# Altium schematic sheet [10] - CPU - GPIO, PWM, LEDS, BUTTONS.SchDoc
size A2; DocumentNumber: 10; SheetNumber: 10; SheetTotal: 31
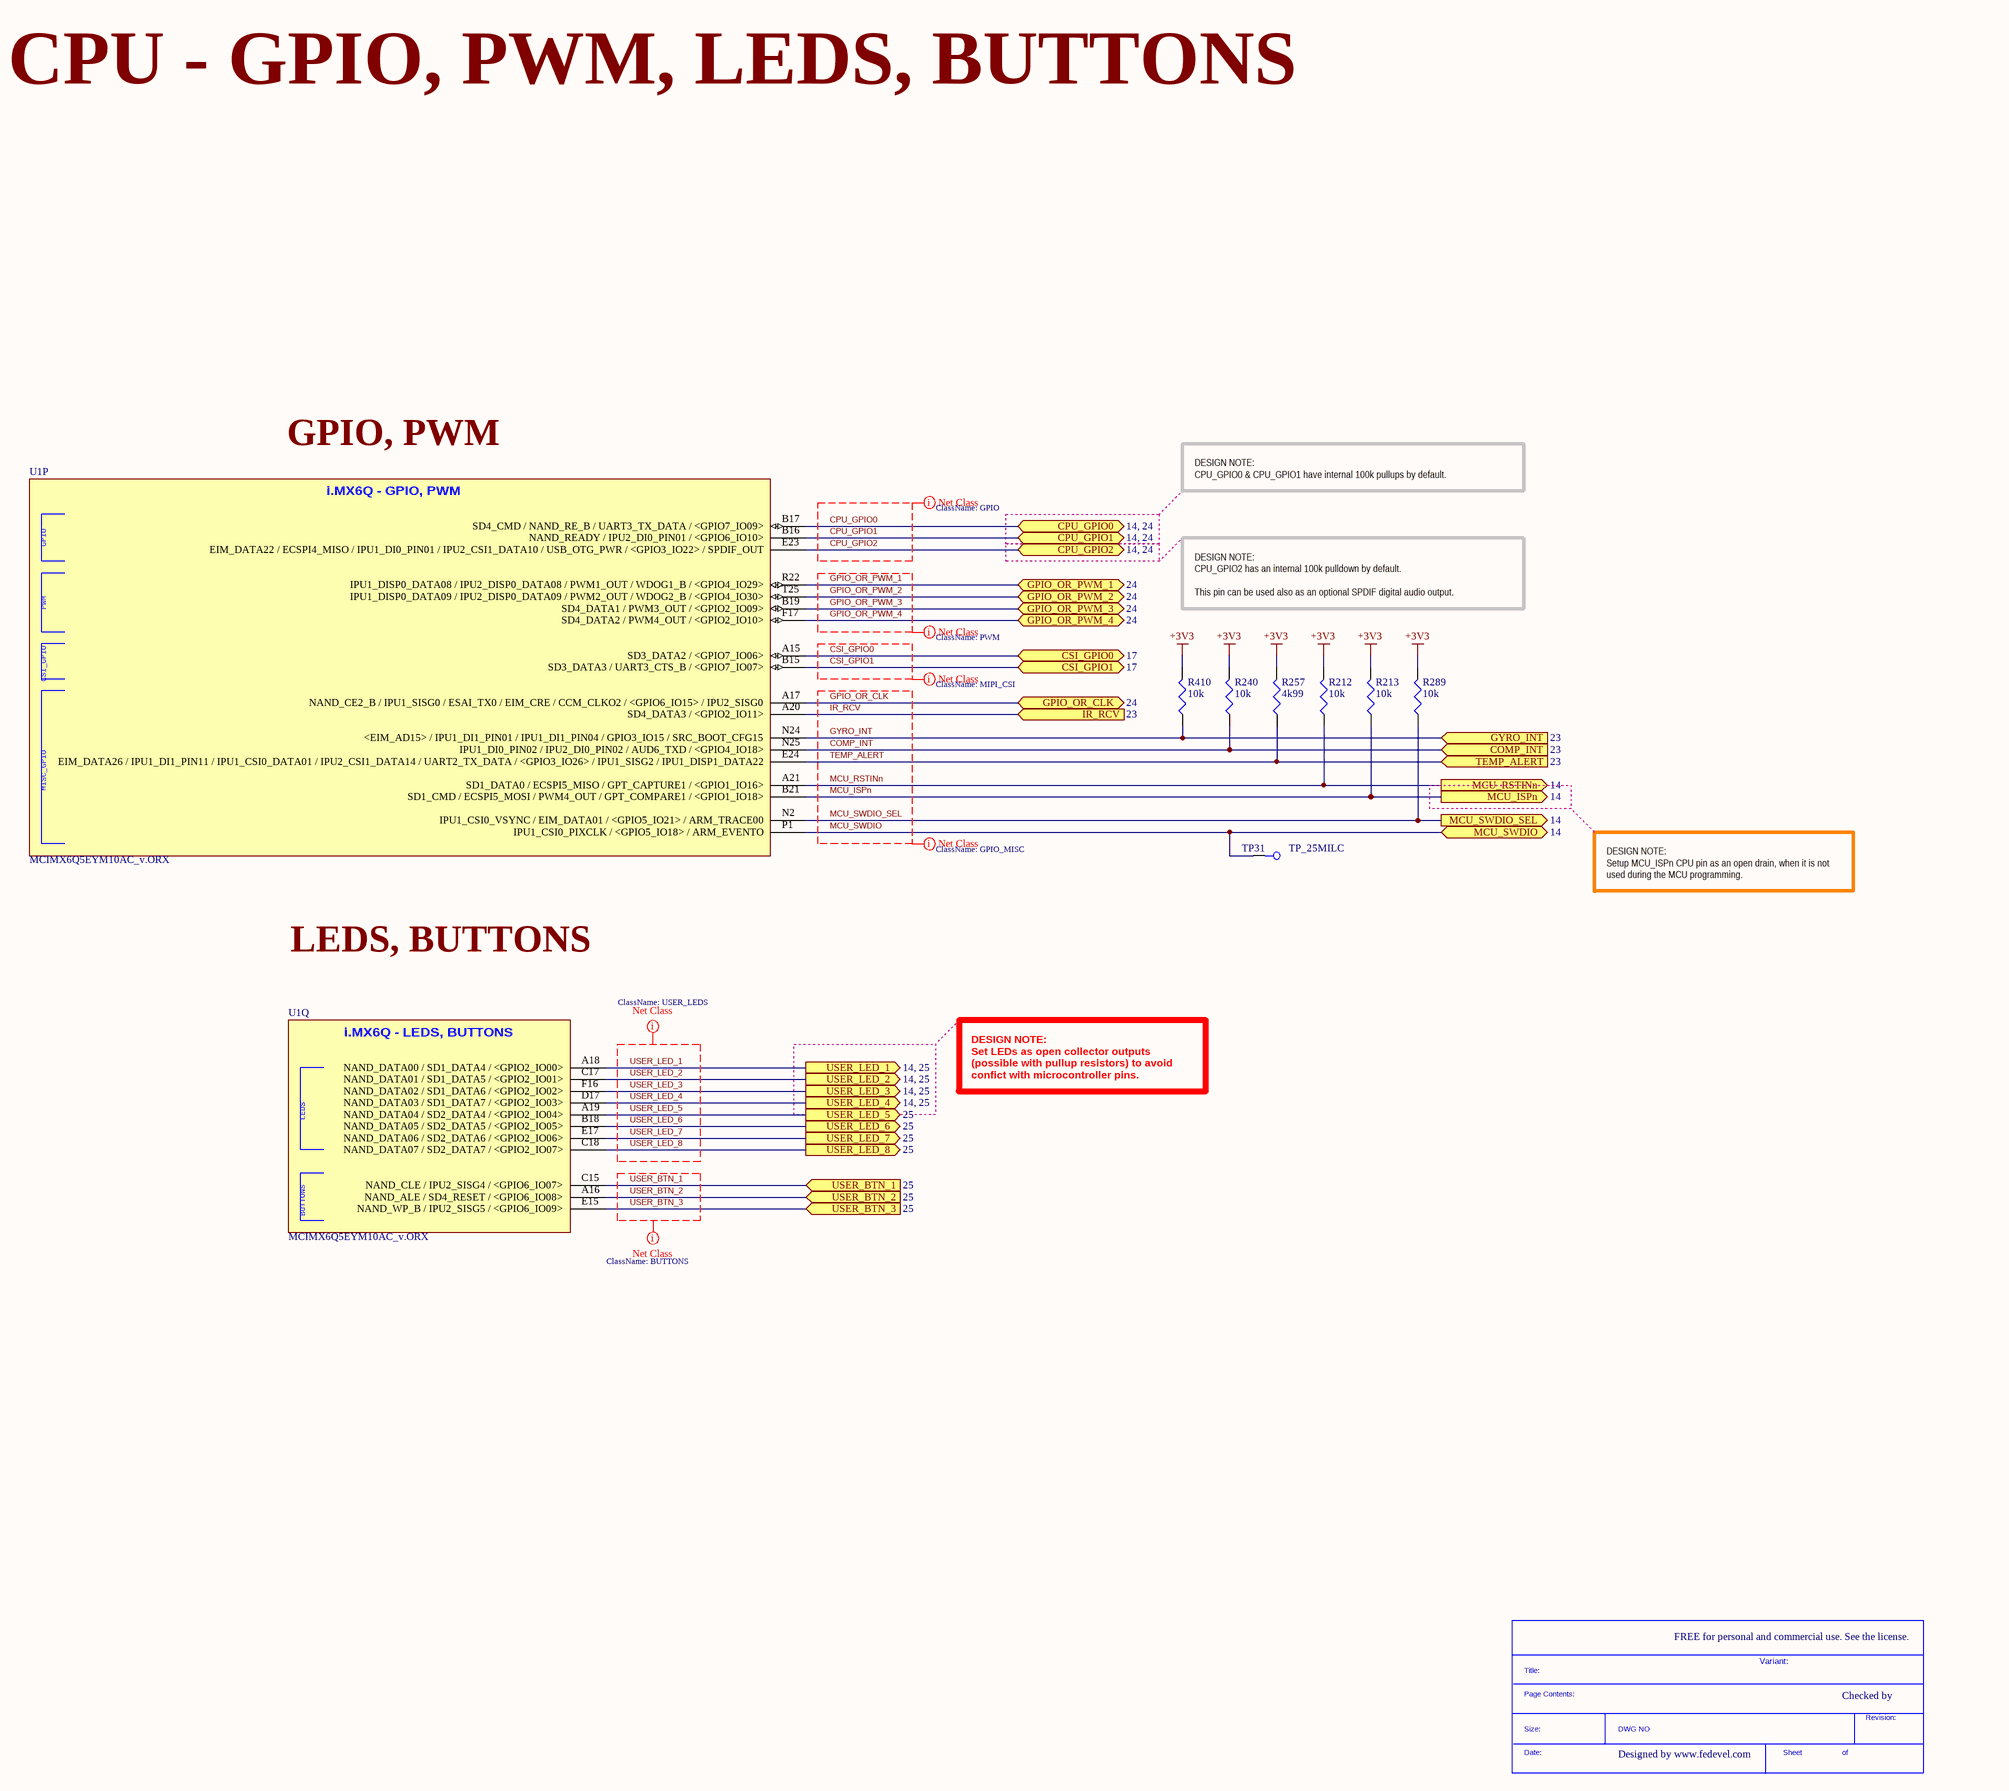
[diagram p0: [10] - CPU - GPIO, PWM, LEDS, BUTTONS.SchDoc]

## Parts
*  SDTitleBlock  (value not drawn)  (graphical)
R212  10k  [R0402]
R213  10k  [R0402]
R240  10k  [R0402]
R257  4k99  [R0402]
R289  10k  [R0402]
R410  10k  [R0402]
TP31  TP_25MILC  [TP_25C]  (no BOM)
U1  MCIMX6Q5EYM10AC_v.ORX  [PBGA624]  (parts P,Q of 21)

## Ports
COMP_INT (in, see 23), CPU_GPIO0 (bidir, see 14, 24), CPU_GPIO1 (bidir, see 14, 24), CPU_GPIO2 (bidir, see 14, 24), CSI_GPIO0 (bidir, see 17), CSI_GPIO1 (bidir, see 17), GPIO_OR_CLK (bidir, see 24), GPIO_OR_PWM_1 (bidir, see 24), GPIO_OR_PWM_2 (bidir, see 24), GPIO_OR_PWM_3 (bidir, see 24), GPIO_OR_PWM_4 (bidir, see 24), GYRO_INT (in, see 23), IR_RCV (in, see 23), MCU_ISPn (out, see 14), MCU_RSTINn (out, see 14), MCU_SWDIO (bidir, see 14), MCU_SWDIO_SEL (out, see 14), TEMP_ALERT (in, see 23), USER_BTN_1 (in, see 25), USER_BTN_2 (in, see 25), USER_BTN_3 (in, see 25), USER_LED_1 (out, see 14, 25), USER_LED_2 (out, see 14, 25), USER_LED_3 (out, see 14, 25), USER_LED_4 (out, see 14, 25), USER_LED_5 (out, see 25), USER_LED_6 (out, see 25), USER_LED_7 (out, see 25), USER_LED_8 (out, see 25)

## Nets
+3V3: R212.2 R213.2 R240.2 R257.2 R289.2 R410.2
COMP_INT: R240.1 U1.N25(IPU1_DI0_PIN02_/_IPU2_DI0_PIN02_/_AUD6_TXD_/_<GPIO4_IO18>) ; port COMP_INT
CPU_GPIO0: U1.B17(SD4_CMD_/_NAND_RE_B_/_UART3_TX_DATA_/_<GPIO7_IO09>) ; port CPU_GPIO0
CPU_GPIO1: U1.B16(NAND_READY_/_IPU2_DI0_PIN01_/_<GPIO6_IO10>) ; port CPU_GPIO1
CPU_GPIO2: U1.E23(EIM_DATA22_/_ECSPI4_MISO_/_IPU1_DI0_PIN01_/_IPU2_CSI1_DATA10_/_USB_OTG_PWR_/_<GPIO3_IO22>_/_SPDIF_OUT) ; port CPU_GPIO2
CSI_GPIO0: U1.A15(SD3_DATA2_/_<GPIO7_IO06>) ; port CSI_GPIO0
CSI_GPIO1: U1.B15(SD3_DATA3_/_UART3_CTS_B_/_<GPIO7_IO07>) ; port CSI_GPIO1
GPIO_OR_CLK: U1.A17(NAND_CE2_B_/_IPU1_SISG0_/_ESAI_TX0_/_EIM_CRE_/_CCM_CLKO2_/_<GPIO6_IO15>_/_IPU2_SISG0) ; port GPIO_OR_CLK
GPIO_OR_PWM_1: U1.R22(IPU1_DISP0_DATA08_/_IPU2_DISP0_DATA08_/_PWM1_OUT_/_WDOG1_B_/_<GPIO4_IO29>) ; port GPIO_OR_PWM_1
GPIO_OR_PWM_2: U1.T25(IPU1_DISP0_DATA09_/_IPU2_DISP0_DATA09_/_PWM2_OUT_/_WDOG2_B_/_<GPIO4_IO30>) ; port GPIO_OR_PWM_2
GPIO_OR_PWM_3: U1.B19(SD4_DATA1_/_PWM3_OUT_/_<GPIO2_IO09>) ; port GPIO_OR_PWM_3
GPIO_OR_PWM_4: U1.F17(SD4_DATA2_/_PWM4_OUT_/_<GPIO2_IO10>) ; port GPIO_OR_PWM_4
GYRO_INT: R410.1 U1.N24(<EIM_AD15>_/_IPU1_DI1_PIN01_/_IPU1_DI1_PIN04_/_GPIO3_IO15_/_SRC_BOOT_CFG15) ; port GYRO_INT
IR_RCV: U1.A20(SD4_DATA3_/_<GPIO2_IO11>) ; port IR_RCV
MCU_ISPn: R213.1 U1.B21(SD1_CMD_/_ECSPI5_MOSI_/_PWM4_OUT_/_GPT_COMPARE1_/_<GPIO1_IO18>) ; port MCU_ISPn
MCU_RSTINn: R212.1 U1.A21(SD1_DATA0_/_ECSPI5_MISO_/_GPT_CAPTURE1_/_<GPIO1_IO16>) ; port MCU_RSTINn
MCU_SWDIO: TP31.1 U1.P1(IPU1_CSI0_PIXCLK_/_<GPIO5_IO18>_/_ARM_EVENTO) ; port MCU_SWDIO
MCU_SWDIO_SEL: R289.1 U1.N2(IPU1_CSI0_VSYNC_/_EIM_DATA01_/_<GPIO5_IO21>_/_ARM_TRACE00) ; port MCU_SWDIO_SEL
TEMP_ALERT: R257.1 U1.E24(EIM_DATA26_/_IPU1_DI1_PIN11_/_IPU1_CSI0_DATA01_/_IPU2_CSI1_DATA14_/_UART2_TX_DATA_/_<GPIO3_IO26>_/_IPU1_SISG2_/_IPU1_DISP1_DATA22) ; port TEMP_ALERT
USER_BTN_1: U1.C15(NAND_CLE_/_IPU2_SISG4_/_<GPIO6_IO07>) ; port USER_BTN_1
USER_BTN_2: U1.A16(NAND_ALE_/_SD4_RESET_/_<GPIO6_IO08>) ; port USER_BTN_2
USER_BTN_3: U1.E15(NAND_WP_B_/_IPU2_SISG5_/_<GPIO6_IO09>) ; port USER_BTN_3
USER_LED_1: U1.A18(NAND_DATA00_/_SD1_DATA4_/_<GPIO2_IO00>) ; port USER_LED_1
USER_LED_2: U1.C17(NAND_DATA01_/_SD1_DATA5_/_<GPIO2_IO01>) ; port USER_LED_2
USER_LED_3: U1.F16(NAND_DATA02_/_SD1_DATA6_/_<GPIO2_IO02>) ; port USER_LED_3
USER_LED_4: U1.D17(NAND_DATA03_/_SD1_DATA7_/_<GPIO2_IO03>) ; port USER_LED_4
USER_LED_5: U1.A19(NAND_DATA04_/_SD2_DATA4_/_<GPIO2_IO04>) ; port USER_LED_5
USER_LED_6: U1.B18(NAND_DATA05_/_SD2_DATA5_/_<GPIO2_IO05>) ; port USER_LED_6
USER_LED_7: U1.E17(NAND_DATA06_/_SD2_DATA6_/_<GPIO2_IO06>) ; port USER_LED_7
USER_LED_8: U1.C18(NAND_DATA07_/_SD2_DATA7_/_<GPIO2_IO07>) ; port USER_LED_8

## Layout directives
net class PWM: GPIO_OR_PWM_1, GPIO_OR_PWM_2, GPIO_OR_PWM_3, GPIO_OR_PWM_4
net class GPIO: CPU_GPIO0, CPU_GPIO1, CPU_GPIO2
net class GPIO_MISC: COMP_INT, GPIO_OR_CLK, GYRO_INT, IR_RCV, MCU_ISPn, MCU_RSTINn, MCU_SWDIO, MCU_SWDIO_SEL, TEMP_ALERT
net class USER_LEDS: USER_LED_1, USER_LED_2, USER_LED_3, USER_LED_4, USER_LED_5, USER_LED_6, USER_LED_7, USER_LED_8
net class BUTTONS: USER_BTN_1, USER_BTN_2, USER_BTN_3
net class MIPI_CSI: CSI_GPIO0, CSI_GPIO1

## Notes on the sheet
- CPU - GPIO, PWM, LEDS, BUTTONS
- GPIO, PWM
- DESIGN NOTE:
  CPU_GPIO0 & CPU_GPIO1 have internal 100k pullups by default.
- DESIGN NOTE:
  CPU_GPIO2 has an internal 100k pulldown by default.
  This pin can be used also as an optional SPDIF digital audio output.
- DESIGN NOTE:
  Setup MCU_ISPn CPU pin as an open drain, when it is not used during the MCU programming.
- LEDS, BUTTONS
- DESIGN NOTE:
  Set LEDs as open collector outputs (possible with pullup resistors) to avoid confict with microcontroller pins.
- FREE for personal and commercial use. See the license.
- Variant:
- Checked by
- Designed by www.fedevel.com
- (in symbol MCIMX6Q5EYM10AC_v.ORX, part P) i.MX6Q - GPIO, PWM; GPIO; PWM; CSI_GPIO; MISC_GPIO
- (in symbol MCIMX6Q5EYM10AC_v.ORX, part Q) i.MX6Q - LEDS, BUTTONS; LEDS; BUTTONS
- (in symbol SDTitleBlock) Title:; Page Contents:; Revision:; Size:; DWG NO; Date:; Sheet; of

## Library data of the parts
R212 R213 R240 R289 R410 = RC0402FR-0710KL: RES 10.0K OHM 1/16W 1% 0402 SMD; Manufacturer: Yageo; Power (Watts): 0.063W, 1/16W; .Checked PCB: used; Temperature Coefficient: ±100ppm/°C; Category: Resistors; Supplier Part Number: 311-10.0KLRCT-ND; Manufacturer Part Number: RC0402FR-0710KL; Package / Case: 0402 (1005 Metric); Price 1k [$]: 0.01421; Resistance (Ohms): 10K; Tolerance: ±1%; Value: 10k; .Checked SCH: used; Supplier: Digikey; Supplier 1: Digi-Key; Supplier Part Number 1: 311-10.0KLRCT-ND; RoHS: RoHS Compliant; Stock 1: 2916495; Pricing 1: 10=0.014, 50=0.0104, 100=0.0079, 250=0.00584, 500=0.00432, 1000=0.00288 (USD); Composition: Thick Film; Features: -; Size / Dimension: 0.039" L x 0.020" W (1.00mm x 0.50mm); Height: 0.016" (0.40mm); Number of Terminations: 2; Packaging: Cut Tape (CT); ComponentLink1URL: http://www.yageo.com/documents/recent/PYu-RC0402_51_RoHS_L_6.pdf; ComponentLink1Description: http://www.yageo.com/documents/recent/PYu-RC0402_51_RoHS_L_6.pdf
R257 = RMCF0402FT4K99: RES TF 4.99K OHM 1% 1/16W 0402; Manufacturer: Stackpole Electronics Inc; Power (Watts): 0.063W, 1/16W; .Checked PCB: used; Temperature Coefficient: ±100ppm/°C; Category: Resistors; Supplier Part Number: RMCF0402FT4K99CT-ND; Manufacturer Part Number: RMCF0402FT4K99; Package / Case: 0402 (1005 Metric); Price 1k [$]: 0.00384; Resistance (Ohms): 4.99K; Tolerance: ±1%; Value: 4k99; .Checked SCH: used; Supplier: Digikey; Supplier 1: Digi-Key; Supplier Part Number 1: RMCF0402FT4K99CT-ND; RoHS: RoHS Compliant; Stock 1: 48509; Pricing 1: 1=0.04, 10=0.025, 50=0.0138, 100=0.0105, 250=0.0078, 500=0.00576, 1000=0.00384 (USD); Composition: Thick Film; Features: -; Size / Dimension: 0.039" L x 0.020" W (1.00mm x 0.50mm); Height: 0.016" (0.40mm); Number of Terminations: 2; Packaging: Cut Tape (CT); ComponentLink1URL: http://www.seielect.com/Catalog/SEI-RMCF.pdf; ComponentLink1Description: http://www.seielect.com/Catalog/SEI-RMCF.pdf
TP31 = TP_25MILC: Test Point 25mil
U1 = MCIMX6Q5EYM10AC_v.ORX: IC MCU 32BIT ARM QUAD 624FCBGA; Manufacturer: Freescale Semiconductor; Core Processor: ARM® Cortex™-A9; Core Size: 32-Bit Quad-Core; Speed: 1.0GHz; Connectivity: CAN, EBI/EMI, ESAI, Ethernet, GPMI, I2C, MMC/SD, PCI, SATA, SPI, UART, USB, USB OTG; Peripherals: DMA, HDMI, I2S/SSI/AC97, MIPI CSI, MIMI DSI, MIPI HIS, PWM, WDT; Number of I /O: 224; Program Memory Type: External Program Memory; RAM Size: 256K x 8; Voltage - Supply (Vcc/Vdd): 0.925 V ~ 1.5 V; Oscillator Type: Internal; .Creator: MM; .Checked PCB: MM, checked by RF; Supplier 1: Digi-Key; Manufacturer Part Number: MCIMX6Q5EYM10AC; RoHS: RoHS Compliant; Category: Integrated Circuits (ICs); Stock 1: 0; Pricing 1: 1=54.98, 10=51.922, 25=48.868, 100=30.5424 (USD); Program Memory Size: -; EEPROM Size: -; Data Converters: -; Operating Temperature: -20°C ~ 105°C; Package / Case: 624-FBGA, FCBGA; Packaging: Tray; ComponentLink1URL: http://cache.freescale.com/files/32bit/doc/data_sheet/IMX6DQCEC.pdf; ComponentLink1Description: http://cache.freescale.com/files/32bit/doc/data_sheet/IMX6DQCEC.pdf; Supplier Part Number 1: MCIMX6Q5EYM10AC-ND